# Altium schematic sheet Expand.SchDoc
size A; DocumentNumber: 4; SheetNumber: 4; SheetTotal: 7
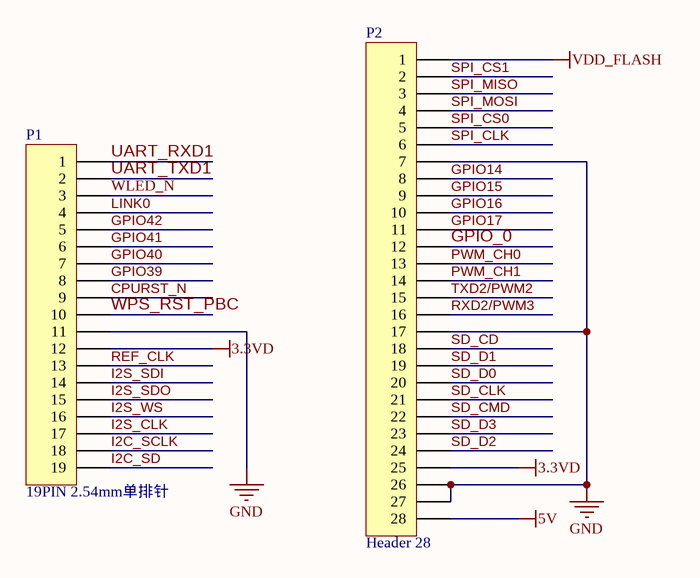
[diagram p0: Expand.SchDoc]

## Parts
P1  19PIN 2.54mm单排针  [HDR1X19]
P2  Header 28  [HDR1X28]

## Nets
3.3VD: P1.12 P2.25
5V: P2.28
GND: P1.11 P2.7 P2.17 P2.26 P2.27
VDD_FLASH: P2.1
CPURST_N: P1.9
GPIO14: P2.8
GPIO15: P2.9
GPIO16: P2.10
GPIO17: P2.11
GPIO39: P1.8
GPIO40: P1.7
GPIO41: P1.6
GPIO42: P1.5
GPIO_0: P2.12
I2C_SCLK: P1.18
I2C_SD: P1.19
I2S_CLK: P1.17
I2S_SDI: P1.14
I2S_SDO: P1.15
I2S_WS: P1.16
LINK0: P1.4
PWM_CH0: P2.13
PWM_CH1: P2.14
REF_CLK: P1.13
RXD2/PWM3: P2.16
SD_CD: P2.18
SD_CLK: P2.21
SD_CMD: P2.22
SD_D0: P2.20
SD_D1: P2.19
SD_D2: P2.24
SD_D3: P2.23
SPI_CLK: P2.6
SPI_CS0: P2.5
SPI_CS1: P2.2
SPI_MISO: P2.3
SPI_MOSI: P2.4
TXD2/PWM2: P2.15
UART_RXD1: P1.1
UART_TXD1: P1.2
WLED_N: P1.3
WPS_RST_PBC: P1.10

## Library data of the parts
P1 = Header 19: Header, 19-Pin; LatestRevisionDate: 17-Jul-2002; LatestRevisionNote: Re-released for DXP Platform.; Publisher: Altium Limited
P2 = Header 28: Header, 28-Pin; LatestRevisionDate: 17-Jul-2002; LatestRevisionNote: Re-released for DXP Platform.; Publisher: Altium Limited